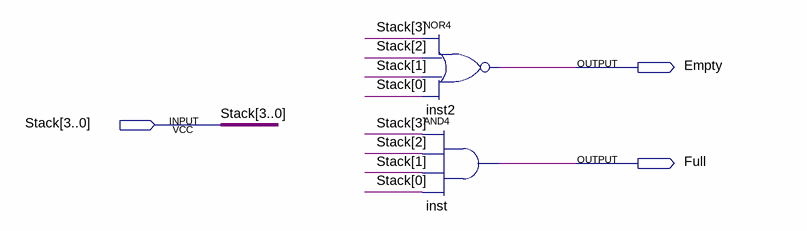
[diagram p0: schematic sheet]
// Quartus schematic output_logic.bdf as structural Verilog: 2 symbols, 3 pins
module output_logic (
  input  [3:0] Stack,
  output Empty,
  output Full
);

  nor inst2 (Empty, Stack[3], Stack[2], Stack[1], Stack[0]);
  and inst (Full, Stack[3], Stack[2], Stack[1], Stack[0]);
endmodule
